# EAGLE schematic XcvrTestWiring (EAGLE 7.6.0)
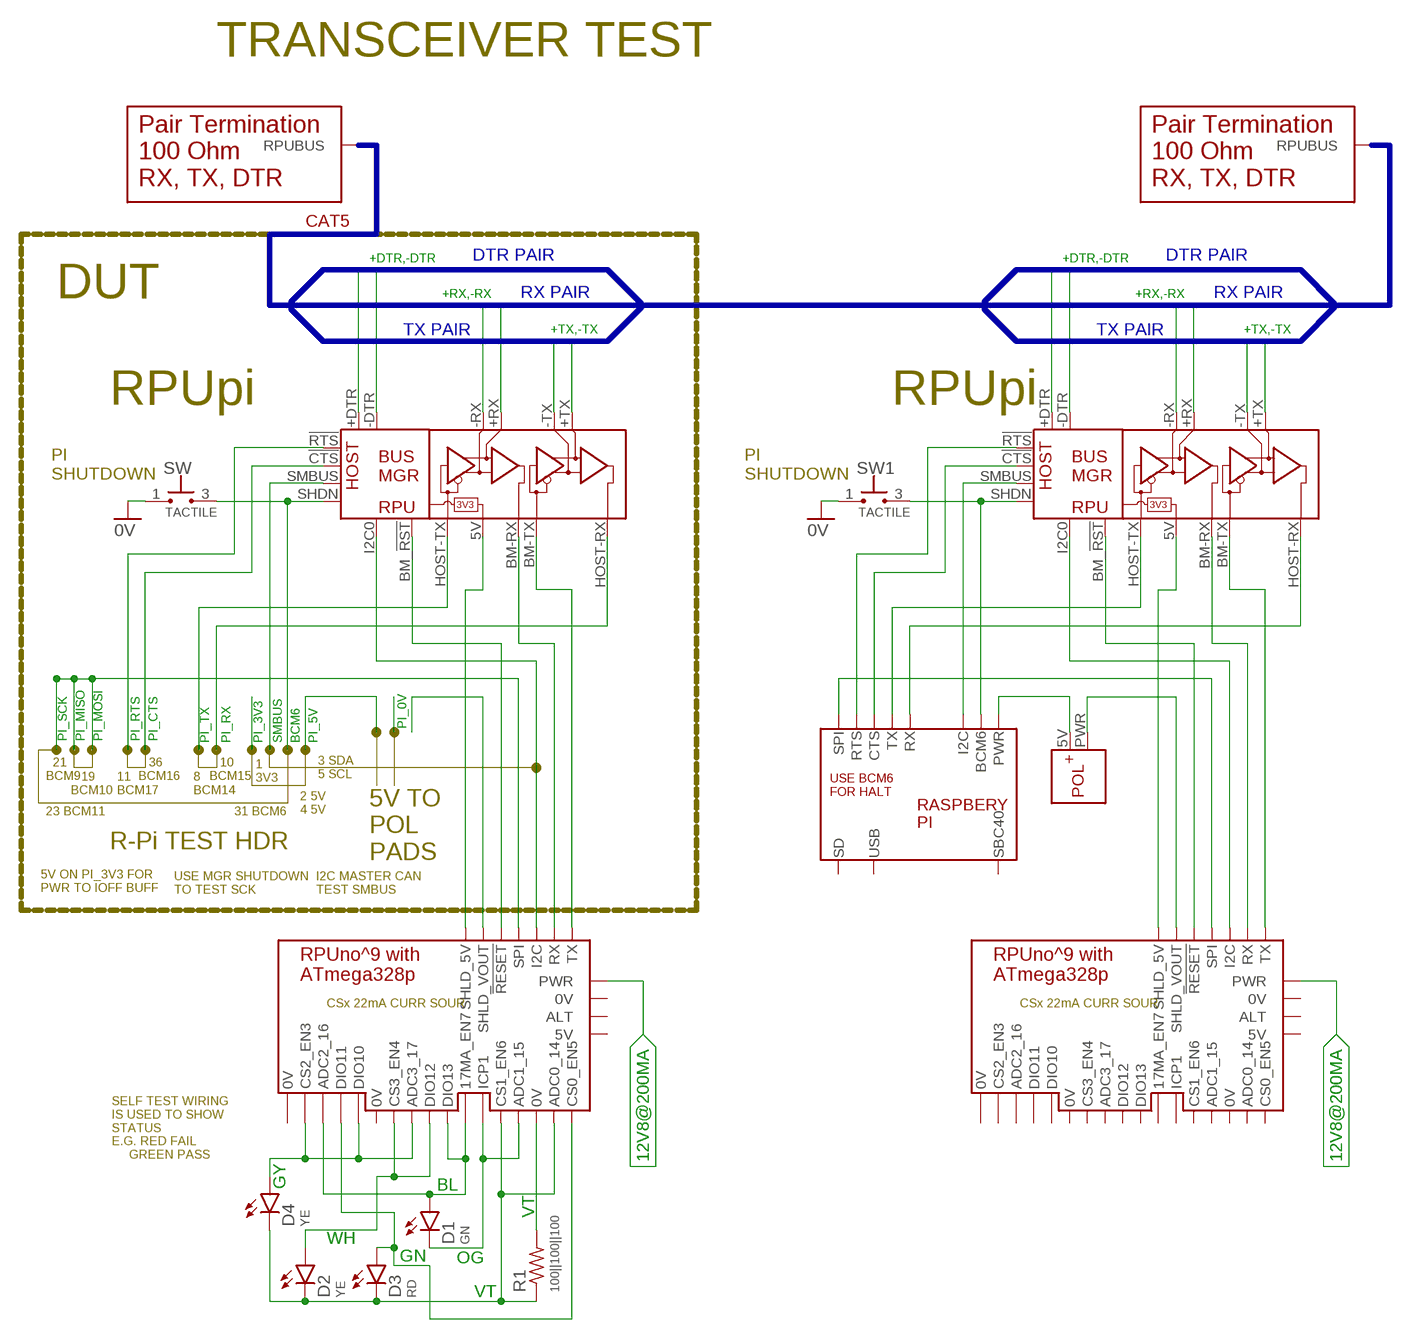
[diagram p0: schematic, sheet 1]

## Parts
BM1  RPUNO  [NA-30]
BM3  RPUNO  [NA-30]
D1  GN  LED5MM  [LED5MM]
D2  YE  LED5MM  [LED5MM]
D3  RD  LED5MM  [LED5MM]
D4  YE  LED5MM  [LED5MM]
R1  100||100||100  R0805  [C0805(2012)]
SW  TACTILE  TAC_SW  [KS11]
SW1  TACTILE  TAC_SW  [KS11]
U$1  TERM  [NA-30]
U$2  BUS_MGR  [WITH_RPU_NAMES]
U$3  TERM  [NA-30]
U$4  PI  [NA-30]
U$5  POL  [WITH_RPU_NAMES]
U$8  BUS_MGR  [WITH_RPU_NAMES]

## Nets
0V: SW1.1 SW.1
12V8@200MA: BM1.8(PWR) BM3.8(PWR)
+DTR: U$2.+DTR U$8.+DTR
+RX: U$2.+RX U$8.+RX
+TX: U$2.+TX U$8.+TX
-DTR: U$2.-DTR U$8.-DTR
-RX: U$2.-RX U$8.-RX
-TX: U$2.-TX U$8.-TX
BCM6: SW1.3 SW.3 U$2.SHDN U$4.7(BCM6) U$8.SHDN
BL: BM3.13(ADC2_16) BM3.18(DIO13) BM3.21(17MA_EN7) D1.A
GN: BM3.14(DIO11) BM3.23(CS0_EN5) D3.A
GY: BM3.15(DIO10) BM3.16(ADC3_17) BM3.24(CS2_EN3) D4.A
N$1: BM3.26(0V) R1.2
N$2: BM3.1(TX) U$8.BM-TX(BM_TX)
N$3: BM3.2(RX) U$8.BM-RX(BM_RX)
N$4: BM3.7(SHLD_VOUT)
N$6: BM1.1(TX) U$2.BM-TX(BM_TX)
N$7: BM1.2(RX) U$2.BM-RX(BM_RX)
N$8: BM1.6(SHLD_5V) U$2.5V(PWR)
N$9: BM1.5(!RESET) U$2.BM_!RST!(BM-!RST!)
N$10: BM1.3(I2C) U$2.I2C0
N$11: BM1.7(SHLD_VOUT) U$5.PWR(VIN)
N$29: BM3.6(SHLD_5V) U$8.5V(PWR)
N$30: BM3.5(!RESET) U$8.BM_!RST!(BM-!RST!)
N$33: BM3.3(I2C) U$8.I2C0
OG: BM3.10(ADC1_15) BM3.12(ICP1) D1.K
PI_5V: U$4.12(PWR) U$5.5V
PI_CTS: U$2.!CTS U$4.1(CTS) U$8.!CTS
PI_MOSI: BM1.4(SPI) BM3.4(SPI) U$4.10(SPI)
PI_RTS: U$2.!RTS U$4.2(RTS) U$8.!RTS
PI_RX: U$2.HOST-RX(HOST_RX) U$4.3(RX) U$8.HOST-RX(HOST_RX)
PI_TX: U$2.HOST-TX(HOST_TX) U$4.4(TX) U$8.HOST-TX(HOST_TX)
SMBUS: U$2.SMBUS U$4.8(I2C) U$8.SMBUS
VT: BM3.11(ADC0_14) BM3.22(CS1_EN6) D2.K D3.K D4.K R1.1
WH: BM3.17(DIO12) BM3.29(CS3_EN4) D2.A
Unconnected: BM1.9(0V) BM1.10(ADC1_15) BM1.11(ADC0_14) BM1.12(ICP1) BM1.13(ADC2_16) BM1.14(DIO11) BM1.15(DIO10) BM1.16(ADC3_17) BM1.17(DIO12) BM1.18(DIO13) BM1.19(5V) BM1.20(ALT) BM1.21(17MA_EN7) BM1.22(CS1_EN6) BM1.23(CS0_EN5) BM1.24(CS2_EN3) BM1.26(0V) BM1.27(0V) BM1.28(0V) BM1.29(CS3_EN4) BM3.9(0V) BM3.19(5V) BM3.20(ALT) BM3.27(0V) BM3.28(0V) U$1.1(RPUBUS) U$3.1(RPUBUS) U$4.5(SBC40) U$4.9(SD) U$4.11(USB)

## Buses
+DTR,-DTR
+RX,-RX
+TX,-TX
B$2
B$1

## Notes on the sheet
- TRANSCEIVER TEST
- CAT5
- DTR PAIR | DTR PAIR
- DUT | RX PAIR | RX PAIR
- TX PAIR | TX PAIR
- RPUpi | RPUpi
- PI
  SHUTDOWN
- PI
  SHUTDOWN
- 3 SDA
  5 SCL
- 21
  BCM9
- 36
  BCM16
- 10
  BCM15
- 1
  3V3
- 19
  BCM10
- 11
  BCM17
- 8
  BCM14
- 2 5V
  4 5V
- 23 BCM11 | 31 BCM6
- R-Pi TEST HDR
- 5V TO
  POL
  PADS
- 5V ON PI_3V3 FOR
  PWR TO IOFF BUFF
- USE MGR SHUTDOWN
  TO TEST SCK
- I2C MASTER CAN
  TEST SMBUS
- SELF TEST WIRING
  IS USED TO SHOW 
  STATUS
  E.G. RED FAIL
       GREEN PASS

## Library data of the parts
BM1 BM3 = Documentation:RPUNO: BM /w 328p
D1-D4 = D-LED:LED: LED 120120WH [CREE,XHGAWT-00-0000-00000HXE1] LED WHITE 6500K 150LUM-W120120
R1 = R-C:R: Resiistor American-style symbol
SW SW1 = S-Tactile:TAC_SW: KS11 [C&K,KS11R21CQE] SWITCH PUSHBUTTON SPST-NO 25MA 50V PAD 0805
U$1 U$3 = Documentation:TERM: Pair Termination 100 Ohm RX, TX, DTR
U$2 U$8 = Documentation:BUS_MGR: RPU BUS MANAGER
U$4 = Documentation:PI: Raspbery Pi
U$5 = Documentation:POL